# EAGLE design controller (EAGLE 6.5.0)
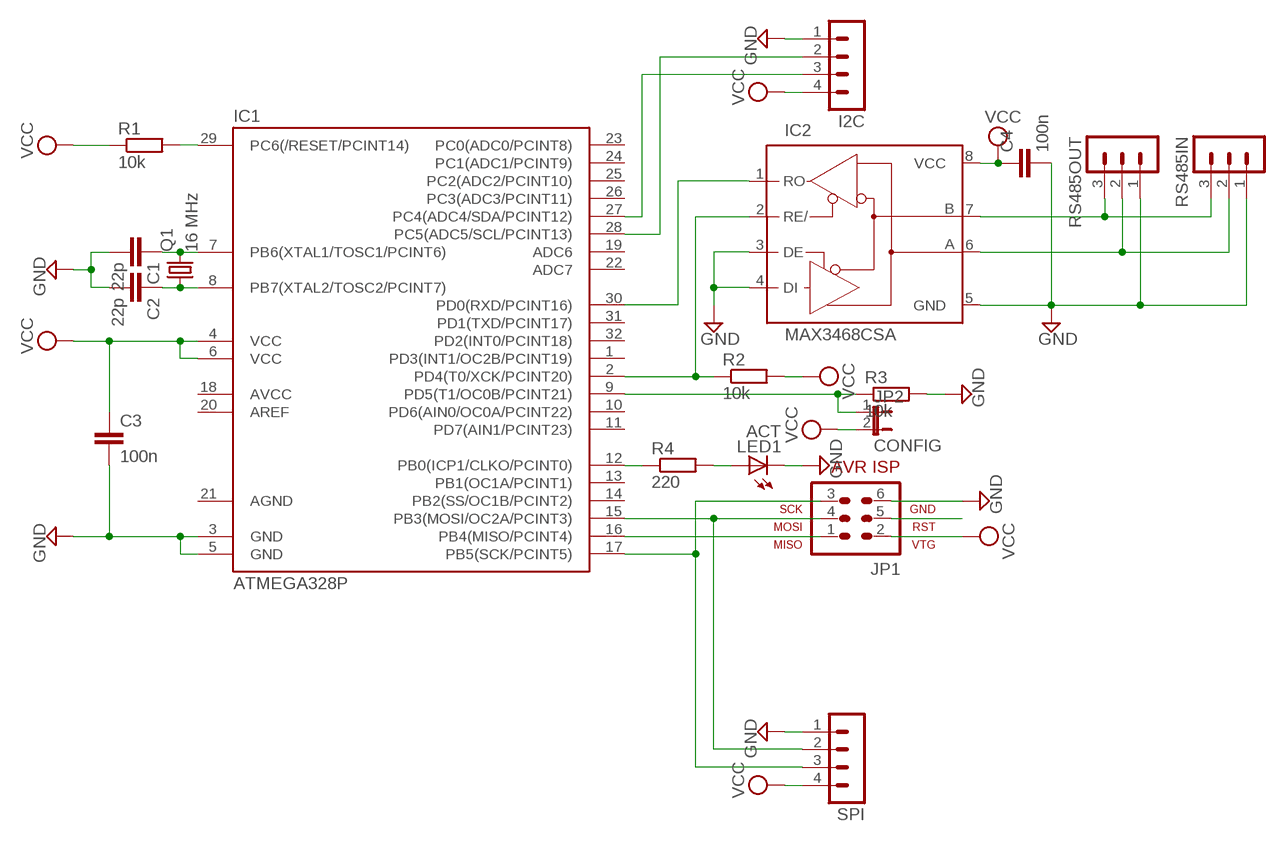
[diagram p0: schematic, sheet 1]

## Parts
C1  22p  C-EUC0805  [C0805]
C2  22p  C-EUC0805  [C0805]
C3  100n  C-EUC0805  [C0805]
C4  100n  C-EUC0805  [C0805]
I2C  MA04-1  [MA04-1]
IC1  ATMEGA328P  MEGA48/88/168-AU  [TQFP32-08]
IC2  MAX3468CSA  [SO08]
JP1  AVR-ISP-6  [AVR-ISP-6]
JP2  CONFIG  JP1E  [JP1]
LED1  ACT  LEDSML0603  [SML0603]
Q1  16 MHz  CRYSTALMT  [MT]
R1  10k  R-EU_R0805  [R0805]
R2  10k  R-EU_R0805  [R0805]
R3  10k  R-EU_R0805  [R0805]
R4  220  R-EU_R0805  [R0805]
RS485IN  MA03-1  [MA03-1]
RS485OUT  MA03-1  [MA03-1]
SPI  MA04-1  [MA04-1]

## Nets
GND: C1.2 C2.2 C3.2 C4.2 I2C.1 IC1.3(GND) IC1.5(GND) IC2.3(DE) IC2.4(DI) IC2.5(GND) JP1.6 LED1.C R3.2 RS485IN.1 RS485OUT.1 SPI.1
N$1: IC1.30(PD0(RXD/PCINT16)) IC2.1(RO)
N$2: IC1.15(PB3(MOSI/OC2A/PCINT3)) JP1.4 SPI.2
N$3: C1.1 IC1.7(PB6(XTAL1/TOSC1/PCINT6)) Q1.P3
N$4: C2.1 IC1.8(PB7(XTAL2/TOSC2/PCINT7)) Q1.P1
N$5: IC1.16(PB4(MISO/PCINT4)) JP1.1
N$6: IC1.17(PB5(SCK/PCINT5)) JP1.3 SPI.3
N$8: IC2.6(A) RS485IN.2 RS485OUT.2
N$9: IC2.7(B) RS485IN.3 RS485OUT.3
N$10: I2C.2 IC1.28(PC5(ADC5/SCL/PCINT13))
N$11: I2C.3 IC1.27(PC4(ADC4/SDA/PCINT12))
N$12: IC1.2(PD4(T0/XCK/PCINT20)) IC2.2(RE/) R2.1
N$13: IC1.9(PD5(T1/OC0B/PCINT21)) JP2.1 R3.1
N$14: IC1.12(PB0(ICP1/CLKO/PCINT0)) R4.1
N$15: LED1.A R4.2
RESET: IC1.29(PC6(/RESET/PCINT14)) JP1.5 R1.2
VCC: C3.1 C4.1 I2C.4 IC1.4(VCC) IC1.6(VCC) IC2.8(VCC) JP1.2 JP2.2 R1.1 R2.2 SPI.4
Unconnected: IC1.1(PD3(INT1/OC2B/PCINT19)) IC1.10(PD6(AIN0/OC0A/PCINT22)) IC1.11(PD7(AIN1/PCINT23)) IC1.13(PB1(OC1A/PCINT1)) IC1.14(PB2(SS/OC1B/PCINT2)) IC1.18(AVCC) IC1.19(ADC6) IC1.20(AREF) IC1.22(ADC7) IC1.23(PC0(ADC0/PCINT8)) IC1.24(PC1(ADC1/PCINT9)) IC1.25(PC2(ADC2/PCINT10)) IC1.26(PC3(ADC3/PCINT11)) IC1.31(PD1(TXD/PCINT17)) IC1.32(PD2(INT0/PCINT18)) Q1.P2(GND) Q1.P4(GND1)

## Power pins joined to a net without a drawn wire
AGND: IC1.21(AGND)

## Library data of the parts
C1-C4 = rcl:C-EU: CAPACITOR, European symbol
I2C SPI = con-lstb:MA04-1: PIN HEADER; OC_FARNELL: unknown; OC_NEWARK: unknown
IC1 = avr-6:MEGA48/88/168
IC2 = maxim:MAX34*: +5V, Fail-Safe, 40Mbps, Profibus RS-485/RS-422 Transceivers Source: MAX3465-MAX3469.pdf; MPN: MAX3468CSA+; OC_FARNELL: unknown; OC_NEWARK: 76K6721
JP1 = avr-6:AVR-ISP-6: AVR ISP-6 Serial Programming Header
JP2 = jumper:JP1E: JUMPER
LED1 = led:LED: LED OSRAM: - CHIPLED LG R971, LG N971, LY N971, LG Q971, LY Q971, LO R971, LY R971 LH N974, LH R974 LS Q976, LO Q976, LY Q976 LO Q996 - Hyper CHIPLED LW Q18S LB Q993, LB Q99A, LB R99A - SideLED LS A670, LO A670, LY A670, LG A670, LP A670 LB A673, LV A673, LT A673, LW A673 LH A674 LY A675 LS A676, LA A676, LO A676, LY A676, LW A676 LS A679, LY A679, LG A679 - Hyper Micro SIDELED® LS Y876, LA Y876, LO Y876, LY Y876 LT Y87S - SmartLED LW L88C, LW L88S LB L89C, LB L89S, LG L890 LS L89K, LO L89K, LY L89K LS L896, LA L896, LO L896, LY L896 - TOPLED LS T670, LO T670, LY T670, LG T670, LP T670 LSG T670, LSP T670, LSY T670, LOP T670, LYG T670 LG T671, LOG T671, LSG T671 LB T673, LV T673, LT T673, LW T673 LH T674 LS T676, LA T676, LO T676, LY T676, LB T676, LH T676, LSB T676, LW T676 LB T67C, LV T67C, LT T67C, LS T67K, LO T67K, LY T67K, LW E67C LS E67B, LA E67B, LO E67B, LY E67B, LB E67C, LV E67C, LT E67C LW T67C LS T679, LY T679, LG T679 LS T770, LO T770, LY T770, LG T770, LP T770 LB T773, LV T773, LT T773, LW T773 LH T774 LS E675, LA E675, LY E675, LS T675 LS T776, LA T776, LO T776, LY T776, LB T776 LHGB T686 LT T68C, LB T68C - Hyper Mini TOPLED® LB M676 - Mini TOPLED Santana® LG M470 LS M47K, LO M47K, LY M47K Source: http://www.osram.convergy.de LUXEON: - LUMILED® LXK2-PW12-R00, LXK2-PW12-S00, LXK2-PW14-U00, LXK2-PW14-V00 LXK2-PM12-R00, LXK2-PM12-S00, LXK2-PM14-U00 LXK2-PE12-Q00, LXK2-PE12-R00, LXK2-PE12-S00, LXK2-PE14-T00, LXK2-PE14-U00 LXK2-PB12-K00, LXK2-PB12-L00, LXK2-PB12-M00, LXK2-PB14-N00, LXK2-PB14-P00, LXK2-PB14-Q00 LXK2-PR12-L00, LXK2-PR12-M00, LXK2-PR14-Q00, LXK2-PR14-R00 LXK2-PD12-Q00, LXK2-PD12-R00, LXK2-PD12-S00 LXK2-PH12-R00, LXK2-PH12-S00 LXK2-PL12-P00, LXK2-PL12-Q00, LXK2-PL12-R00 Source: www.luxeon.com KINGBRIGHT: KA-3528ASYC Source: www.kingbright.com
Q1 = Crystals-new:CRYSTAL
R1-R4 = rcl:R-EU_: RESISTOR, European symbol
RS485IN RS485OUT = con-lstb:MA03-1: PIN HEADER; OC_FARNELL: unknown; OC_NEWARK: unknown

## Board
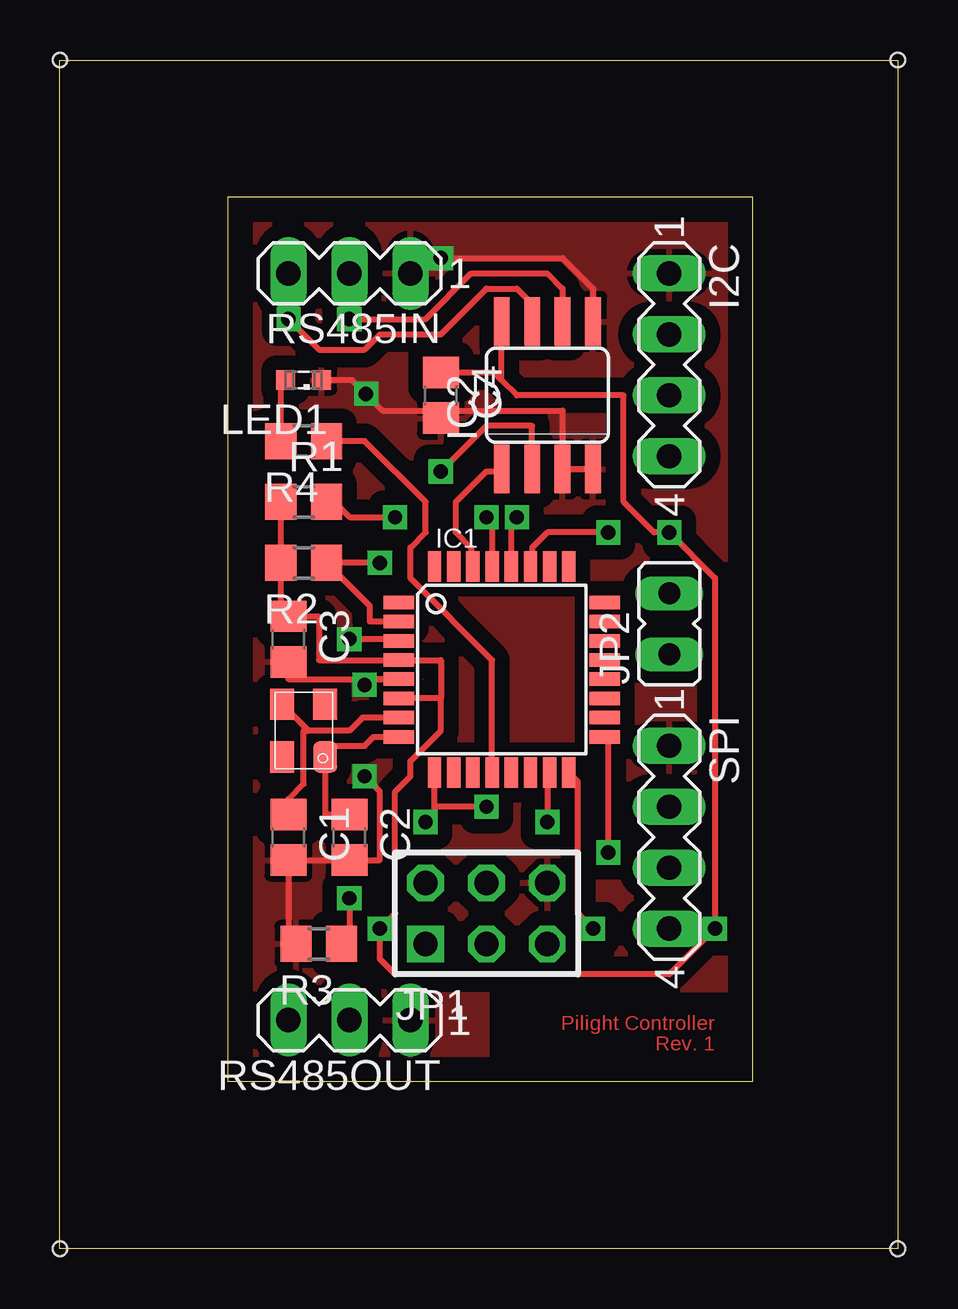
[diagram p1: board, top side]
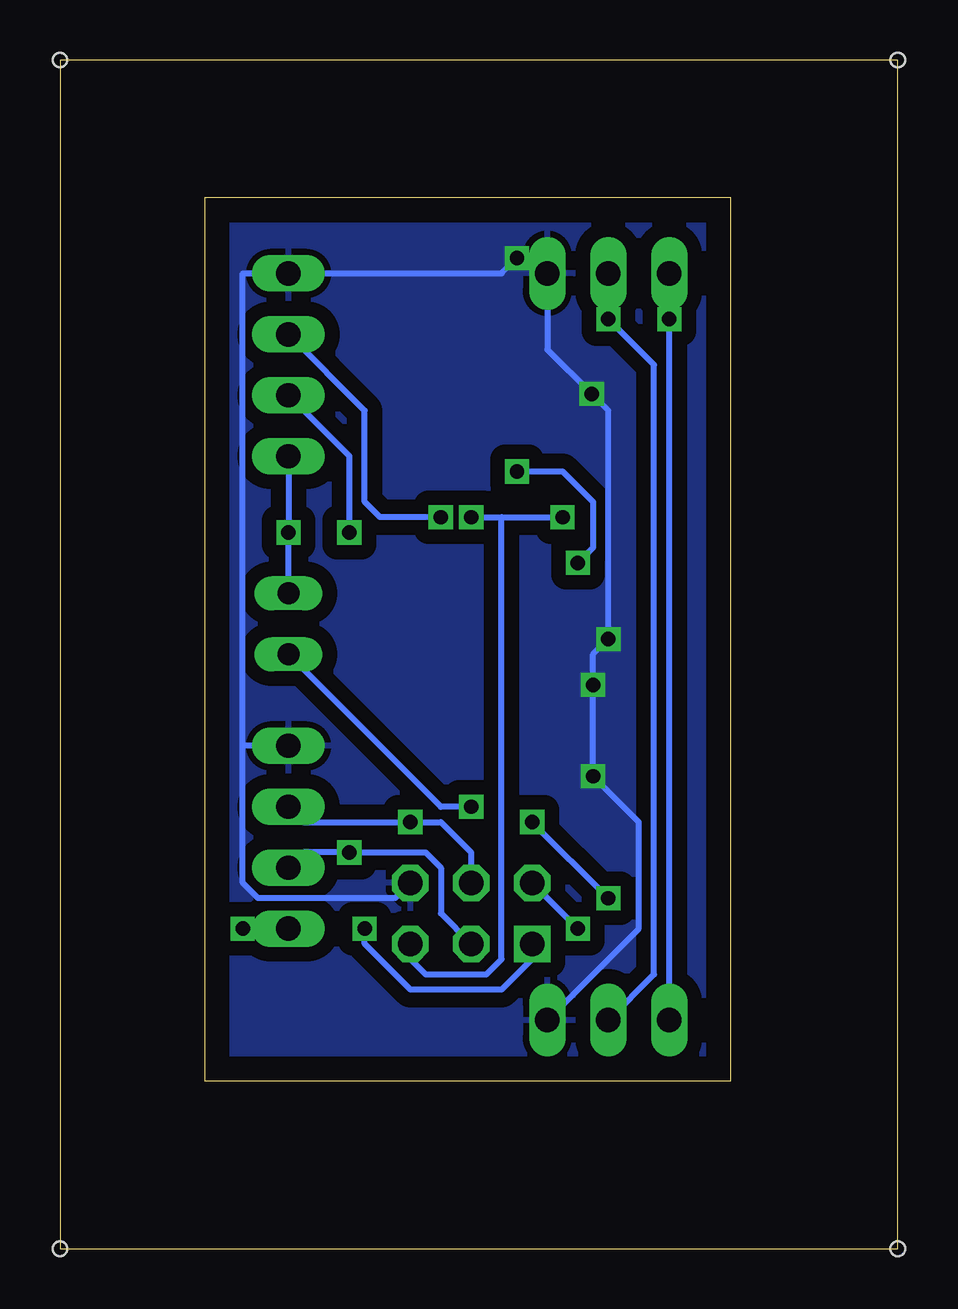
[diagram p2: board, bottom side, seen from below]

Size 34.93 x 49.53 mm. Coordinates in mm from the lower left corner, seen from the top.
Outline: 6.99,6.99 28.88,6.99 28.88,43.8 6.99,43.8 6.99,6.99
Outline: 0,49.53 34.93,49.53 34.93,0 0,0 0,49.53
Copper layers (1*16): Top 0.035mm / dielectric 1.5mm / Bottom 0.035mm
Design rules "default *": minimum track width 10mil, minimum drill 20mil, track to track 8mil, track to pad 8mil, pad to pad 8mil, via to via 8mil, smd to smd 8mil, copper to edge 40mil, drill to drill 8mil, minimum pad ring 10mil, minimum via ring 8mil, stop-mask expansion 4mil, vias tented up to drill 0mil, thermal gap 10mil
Holes 0.6 mm at 0,49.53 34.93,49.53 34.93,0 0,0

### Footprints (pad centres in the part's own frame; a part is rotated, then mirrored left to right if it is on the bottom)
C0805 = smd 1.3 x 1.5: 1 -0.95,0; 2 0.95,0
MA04-1 = drill 1.016 long: 1 -3.81,0; 2 -1.27,0; 3 1.27,0; 4 3.81,0
TQFP32-08 = smd 1.27 x 0.559: 1 -4.293,2.8; 2 -4.293,2; 3 -4.293,1.2; 4 -4.293,0.4; 5 -4.293,-0.4; 6 -4.293,-1.2; 7 -4.293,-2; 8 -4.293,-2.8; 17 4.293,-2.8; 18 4.293,-2; 19 4.293,-1.2; 20 4.293,-0.4; 21 4.293,0.4; 22 4.293,1.2; 23 4.293,2; 24 4.293,2.8 | smd 0.559 x 1.27: 9 -2.8,-4.293; 10 -2,-4.293; 11 -1.2,-4.293; 12 -0.4,-4.293; 13 0.4,-4.293; 14 1.2,-4.293; 15 2,-4.293; 16 2.8,-4.293; 25 2.8,4.293; 26 2,4.293; 27 1.2,4.293; 28 0.4,4.293; 29 -0.4,4.293; 30 -1.2,4.293; 31 -2,4.293; 32 -2.8,4.293
SO08 = smd 0.66 x 2.032: 1 -1.905,-3.073; 2 -0.635,-3.073; 3 0.635,-3.073; 4 1.905,-3.073; 5 1.905,3.073; 6 0.635,3.073; 7 -0.635,3.073; 8 -1.905,3.073
AVR-ISP-6 = drill 1.016 square: 1 -2.54,-1.27 | drill 1.016 octagon: 2 -2.54,1.27; 3 0,-1.27; 4 0,1.27; 5 2.54,-1.27; 6 2.54,1.27
JP1 = drill 0.914 long: 1 0,-1.27; 2 0,1.27
SML0603 = smd 0.8 x 0.8: A 0.75,0; C -0.75,0
MT = smd 1.3 x 1: P1 -1.1,-0.9; P2 1.1,-0.9; P3 1.1,0.9; P4 -1.1,0.9
R0805 = smd 1.3 x 1.5: 1 -0.95,0; 2 0.95,0
MA03-1 = drill 1.016 long: 1 -2.54,0; 2 0,0; 3 2.54,0

### Placement (x,y rotation side)
C1  9.53,17.14 270 top
C2  12.07,17.14 270 top
C3  9.53,25.4 270 top
C4  15.88,35.56 270 top
I2C  25.4,36.83 270 top
IC1  18.41,24.13 0 top
IC2  20.32,35.56 0 top
JP1  17.78,13.97 0 top
JP2  25.4,26.04 0 top
LED1  10.16,36.2 180 top
Q1  10.16,21.59 90 top
R1  10.16,31.11 0 top
R2  10.16,28.57 180 top
R3  10.79,12.7 180 top
R4  10.16,33.66 180 top
RS485IN  12.07,40.64 180 top
RS485OUT  12.07,9.53 180 top
SPI  25.4,17.14 270 top

### Tracks (layer width: path | path; a pad name or v marks a point on that pad's centre or on a via)
GND  (via drill 0.6)
  Top 0.254: IC2.4 IC2.3 20.96,34.93 15.88,34.93 | 15.88,34.93 13.45,34.93 v12.76,35.62 12.18,36.2 LED1.C | v12.7,19.68 13.34,19.05 13.34,16.2 C2.2 C1.2 9.53,13.02 R3.2 | v12.7,23.5 12.7,23.73 IC1.5 9.53,23.73 C3.2 | IC1.3 14.05,25.4 v12.07,25.4 | v15.88,41.27 20.96,41.27 22.23,40.01 IC2.5 | C4.2 15.88,34.93
  Bottom 0.254: JP1.6 20.96,14.61 26.67,14.61 27.3,15.24 27.3,20.96 | 27.3,20.96 27.3,40.64 I2C.1 16.51,40.64 v15.88,41.27 15.24,41.27 RS485IN.1 14.61,37.47 v12.76,35.62 12.07,34.93 v12.07,25.4 12.7,24.77 v12.7,23.5 v12.7,19.68 10.79,17.78 10.79,13.34 RS485OUT.1 | SPI.1 27.3,20.96
  pour Bottom (isolate 0.61): 7.62,43.18 28.57,43.18 28.57,7.62 7.62,7.62
  pour Top (isolate 0.61): 7.62,43.18 28.57,43.18 28.57,10.79 17.78,10.79 17.78,7.62 7.62,7.62
N$1
  Top 0.254: IC1.30 17.14,28.49 17.14,29.21 16.51,29.84 16.51,31.11 17.78,32.38 18.31,32.38 IC2.1
N$2  (via drill 0.6)
  Top 0.254: IC1.15 20.32,19.74 v20.32,17.78
  Bottom 0.254: SPI.2 24.77,17.78 v20.32,17.78 19.05,17.78 17.78,16.51 JP1.4
N$3
  Top 0.254: IC1.7 12.61,22.13 12.07,21.59 10.36,21.59 | 10.36,21.59 Q1.P3 | 10.36,21.59 10.16,21.59 10.16,19.37 9.53,18.73 C1.1
N$4
  Top 0.254: C2.1 11.06,18.09 Q1.P1 11.06,20.96 12.7,20.96 13.07,21.33 IC1.8
N$5  (via drill 0.6)
  Top 0.254: v22.23,13.34 21.59,13.97 21.59,19.46 IC1.16
  Bottom 0.254: v22.23,13.34 22.23,12.7 20.32,10.79 16.51,10.79 15.24,12.07 JP1.1
N$6  (via drill 0.6)
  Top 0.254: v22.86,16.51 22.86,21.18 IC1.17
  Bottom 0.254: JP1.3 19.05,13.97 19.05,15.88 19.68,16.51 v22.86,16.51 24.77,16.51 SPI.3
N$8  (via drill 0.6)
  Top 0.254: v12.07,38.73 15.24,38.73 17.14,40.64 20.32,40.64 20.96,40.01 IC2.6
  Bottom 0.254: RS485OUT.2 10.16,11.43 10.16,36.83 v12.07,38.73 RS485IN.2
N$9  (via drill 0.6)
  Top 0.254: v9.53,38.73 10.79,37.47 12.7,37.47 13.34,38.1 15.88,38.1 17.78,40.01 19.05,40.01 19.68,39.37 IC2.7
  Bottom 0.254: RS485OUT.3 v9.53,38.73 RS485IN.3
N$10  (via drill 0.6)
  Top 0.254: IC1.28 18.82,30.48 v19.05,30.48
  Bottom 0.254: v19.05,30.48 21.59,30.48 22.23,31.11 22.23,34.93 I2C.2
N$11  (via drill 0.6)
  Top 0.254: v22.86,29.84 20.32,29.84 19.68,29.21 19.68,28.49 IC1.27
  Bottom 0.254: v22.86,29.84 22.86,33.02 I2C.3
N$12  (via drill 0.6)
  Top 0.254: IC1.2 12.92,26.13 12.92,26.77 R2.1 v13.34,28.57 | IC2.2 19.68,34.29 17.78,34.29 v15.88,32.38
  Bottom 0.254: v15.88,32.38 13.97,32.38 12.7,31.11 12.7,29.21 v13.34,28.57
N$13  (via drill 0.6)
  Top 0.254: v15.24,17.78 15.62,17.78 15.62,18.41 | 15.62,18.41 IC1.9 | v17.78,18.41 15.62,18.41 | v12.07,14.61 12.07,13.02 R3.1
  Bottom 0.254: v12.07,14.61 v15.24,17.78 | v17.78,18.41 19.05,18.41 JP2.1
N$14
  Top 0.254: IC1.12 18.02,24.53 14.61,27.94 14.61,29.21 15.24,29.84 15.24,31.11 12.7,33.66 R4.1 11.43,33.66
N$15
  Top 0.254: R4.2 9.21,36.2 LED1.A
RESET  (via drill 0.6)
  Top 0.254: R1.2 11.43,31.11 12.07,30.48 v13.97,30.48 | v17.78,30.48 18.02,30.25 IC1.29
  Bottom 0.254: v17.78,30.48 16.51,30.48 | 16.51,30.48 v13.97,30.48 | JP1.5 20.32,12.07 19.68,11.43 17.14,11.43 16.51,12.07 16.51,30.48
VCC  (via drill 0.6)
  Top 0.254: R1.1 R2.2 9.21,26.35 C3.1 10.79,26.35 10.79,24.53 IC1.4 15.88,24.53 15.88,22.93 | 15.88,22.93 15.88,21.59 14.61,20.32 14.61,19.68 13.97,19.05 13.97,13.97 v13.34,13.34 13.34,12.07 13.97,11.43 25.4,11.43 v27.3,13.34 27.3,27.94 v25.4,29.84 24.77,29.84 23.5,31.11 23.5,35.56 19.05,35.56 18.41,36.2 | 15.88,22.93 IC1.6 | 18.41,36.2 IC2.8 | C4.1 18.1,36.51 18.41,36.2
  Bottom 0.254: I2C.4 v25.4,29.84 JP2.2 | JP1.2 v13.34,13.34 | v27.3,13.34 SPI.4

### Text on the board
Top: Pilight Controller / Rev. 1